# EAGLE design flower (EAGLE 7.7.0)
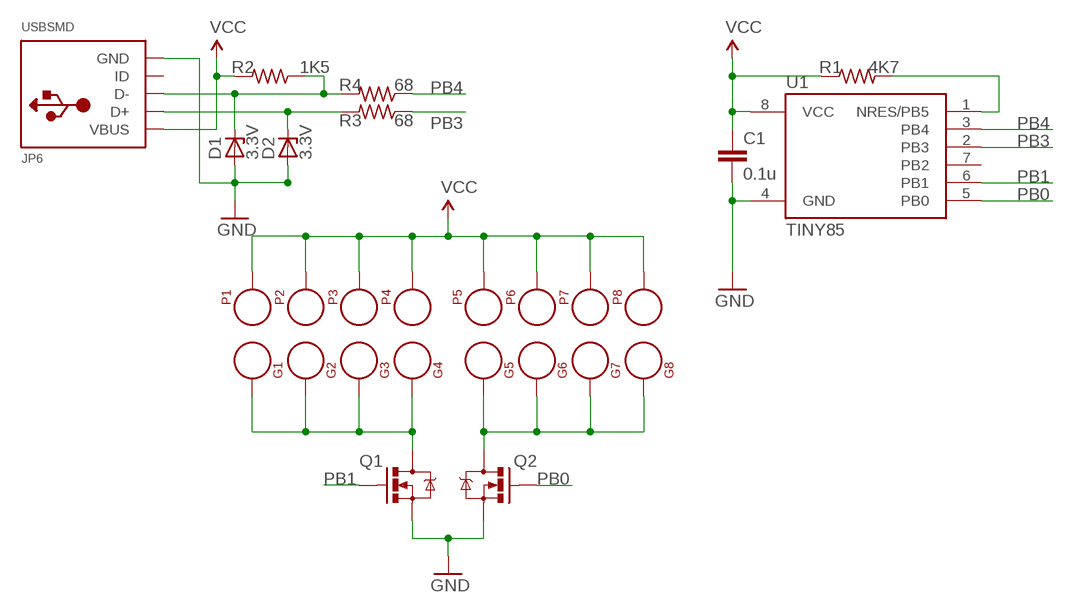
[diagram p0: schematic, sheet 1]

## Parts
C1  0.1u  C-EU025-025X050  [C025-025X050]
D1  3.3V  ZENER-DIODEZD-5  [ZDIO-5]
D2  3.3V  ZENER-DIODEZD-5  [ZDIO-5]
G1  SEW_HOLE  [SIMPLE_HOLE]
G2  SEW_HOLE  [SIMPLE_HOLE]
G3  SEW_HOLE  [SIMPLE_HOLE]
G4  SEW_HOLE  [SIMPLE_HOLE]
G5  SEW_HOLE  [SIMPLE_HOLE]
G6  SEW_HOLE  [SIMPLE_HOLE]
G7  SEW_HOLE  [SIMPLE_HOLE]
G8  SEW_HOLE  [SIMPLE_HOLE]
JP6  USBSMD  USBMOLEX  [USB-MINIB-THM-MOLEX]
P1  SEW_HOLE  [SIMPLE_HOLE]
P2  SEW_HOLE  [SIMPLE_HOLE]
P3  SEW_HOLE  [SIMPLE_HOLE]
P4  SEW_HOLE  [SIMPLE_HOLE]
P5  SEW_HOLE  [SIMPLE_HOLE]
P6  SEW_HOLE  [SIMPLE_HOLE]
P7  SEW_HOLE  [SIMPLE_HOLE]
P8  SEW_HOLE  [SIMPLE_HOLE]
Q1  2N7000  MOSFET-NCHANNEL2N7000  [TO-92]
Q2  2N7000  MOSFET-NCHANNEL2N7000  [TO-92]
R1  4K7  R-US_0204/7  [0204/7]
R2  1K5  R-US_0204/7  [0204/7]
R3  68  R-US_0204/7  [0204/7]
R4  68  R-US_0204/7  [0204/7]
U1  TINY85  ATTINY85-P  [PDIP08_300MIL]

## Nets
A: G5.P$1 G6.P$1 G7.P$1 G8.P$1 Q2.3(D)
B: G1.P$1 G2.P$1 G3.P$1 G4.P$1 Q1.3(D)
GND: C1.2 D1.A D2.A JP6.GND Q1.1(S) Q2.1(S) U1.4(GND)
N$2: D2.C JP6.D+ R3.2
N$3: R1.2 U1.1(NRES/PB5)
N$6: D1.C JP6.D- R2.1 R4.2
PB0: Q2.2(G) U1.5(PB0)
PB1: Q1.2(G) U1.6(PB1)
PB3: R4.1 U1.2(PB3)
PB4: R3.1 U1.3(PB4)
VCC: C1.1 JP6.VBUS P1.P$1 P2.P$1 P3.P$1 P4.P$1 P5.P$1 P6.P$1 P7.P$1 P8.P$1 R1.1 R2.2 U1.8(VCC)
Unconnected: JP6.ID U1.7(PB2)

## Library data of the parts
C1 = rcl:C-EU: CAPACITOR, European symbol
D1 D2 = diode:ZENER-DIODE: Z-Diode
G1-G8 P1-P8 = LilyPad-Wearables:SEW_HOLE: Simple sew-hole .1" diameter hole with 20mil annular ring
JP6 = adafruit:USB: USB Connectors USBMINIB - Surface Mount Female Mini-B USB Connector 4UConnector: 06564 By microbuilder.eu Thru-hole RA Female Mini-B USB Connector 4UConnector: 18732 By ladyada.net
Q1 Q2 = SparkFun-DiscreteSemi:MOSFET-NCHANNEL: Common NMOSFET Parts MFG P/N Store ID Prod ID FDD8780 TRANS-09984 SI7820DN TRANS-11055 FDS6630A IC-08089 2N7002PW TRANS-11151 FQP30N06L COM-10213 TRANS-10060 BSS123LT1G TRANS-08345 BSS138 TRANS-00830 BS170 2N7000
R1-R4 = resistor:R-US_: RESISTOR, American symbol
U1 = _hhn_attiny25_45_85:ATTINY85*: ATMEL ATtiny 85 Packages: P = PDIP 08 30mil S = SOIC 08 EIAJ 208mil Technologies Note: for complete ordering code (temp. range, finish, tape&reel etc.) see www.atmel.com • Supply Voltage: V = (1.8…5.5)V | [blank] = (2.7…5.5)V • Speed: 10 = 10 MHz | 20 = 20 MHz Author: Dipl.-Ing. FH Rainer Bayer HHN Hochschule Heilbronn (Heilbronn University), rainer.bayer@hs-heilbronn.de Ingenieurbüro ing-rb, mail@ing-rb.de

## Board
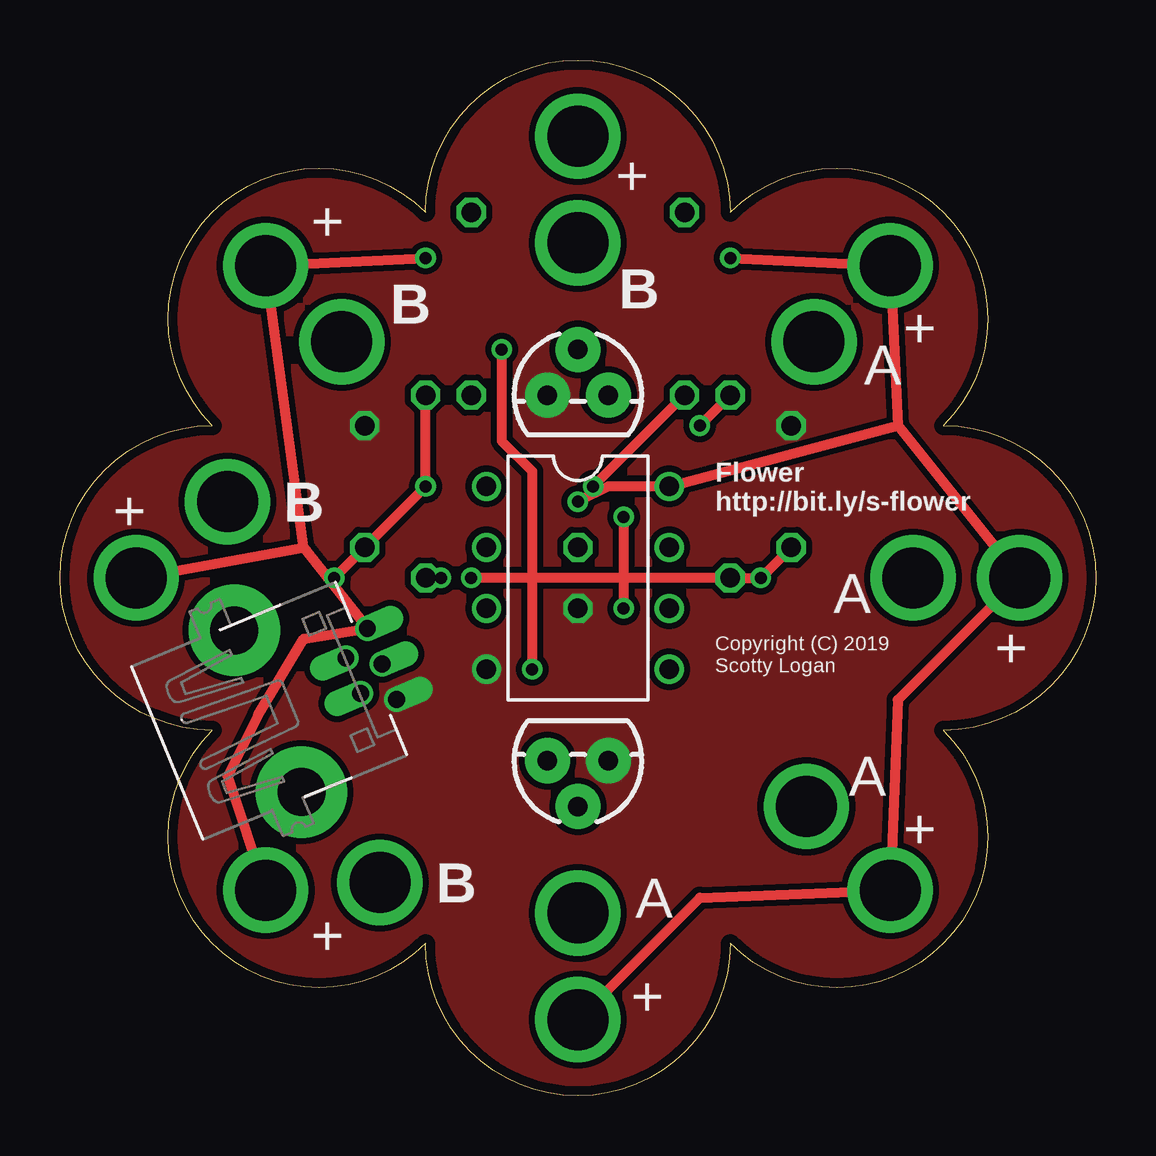
[diagram p1: board, top side]
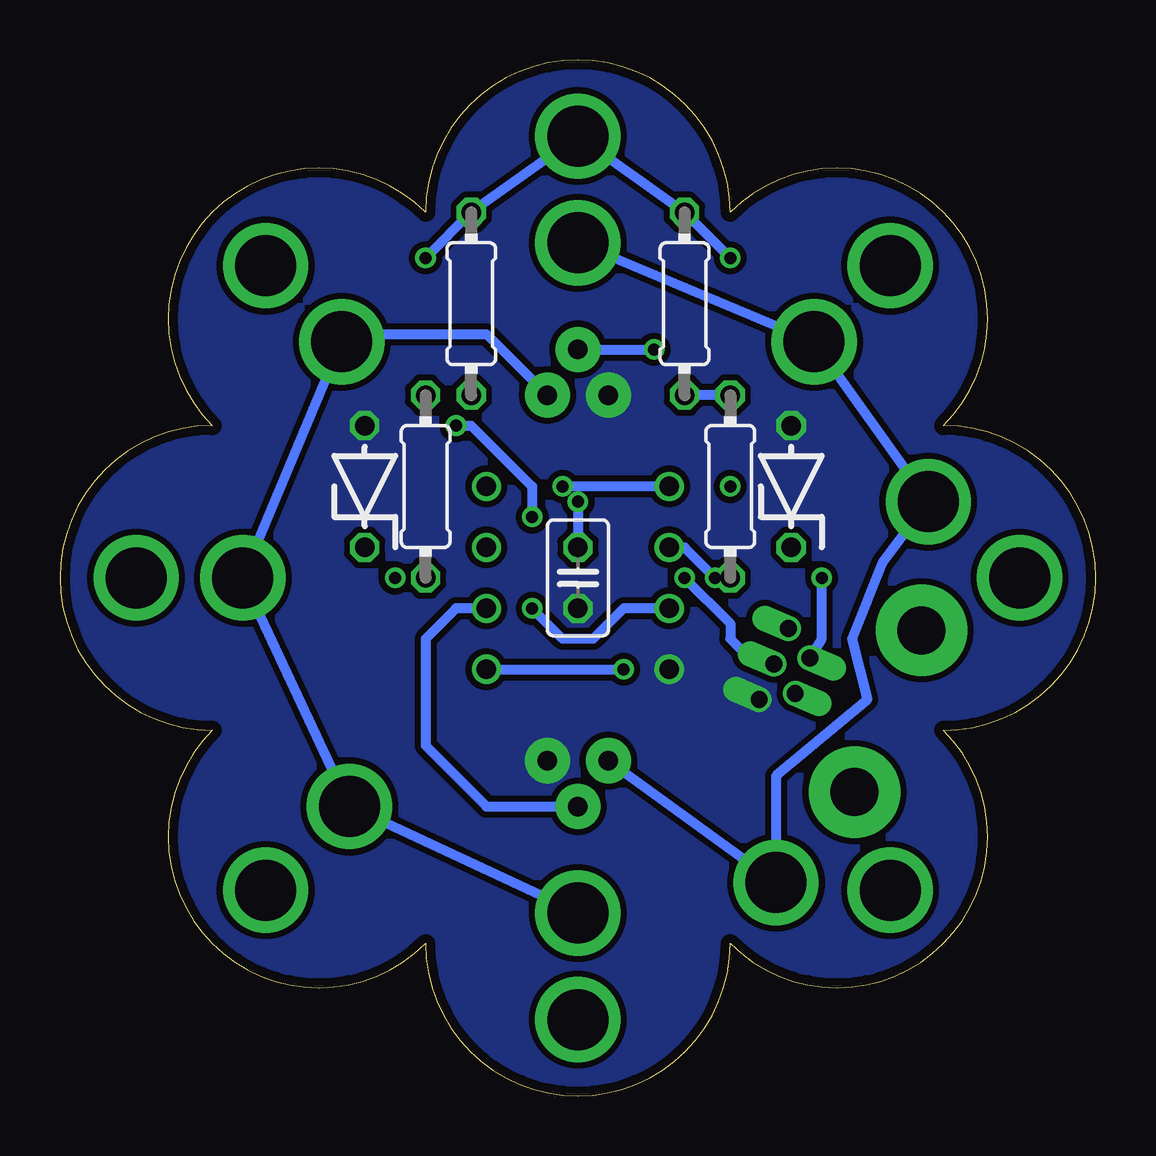
[diagram p2: board, bottom side, seen from below]

Size 43.18 x 43.18 mm. Coordinates in mm from the lower left corner, seen from the top.
Outline: 15.24,6.35 arc-180 6.35,15.24 arc-180 6.35,27.94 arc-180 15.24,36.83 arc-180 27.94,36.83 arc-180 36.83,27.94 arc-180 36.83,15.24 arc-180 27.94,6.35 arc-180 15.24,6.35
Copper layers (1*16): Top 0.0356mm / dielectric 1.5011mm / Bottom 0.0356mm
Design rules "OSH Park PCB Order": minimum track width 6mil, minimum drill 13mil, track to track 6mil, track to pad 6mil, pad to pad 6mil, via to via 6mil, smd to smd 6mil, copper to edge 15mil, drill to drill 6mil, minimum pad ring 7mil, minimum via ring 7mil, stop-mask expansion 3mil, vias tented up to drill 0mil, thermal gap 10mil

### Footprints (pad centres in the part's own frame; a part is rotated, then mirrored left to right if it is on the bottom)
C025-025X050 = drill 0.813 octagon: 1 -1.27,0; 2 1.27,0
ZDIO-5 = drill 0.813 octagon: A 2.54,0; C -2.54,0
SIMPLE_HOLE = drill 2.54 pad 3.048: P$1 0,0
USB-MINIB-THM-MOLEX = drill 0.7 offset: D+ 0,9.72; D- -0.8,8.42; GND 1.6,9.72; ID 0.8,8.42; VBUS -1.6,9.72 | drill 2 pad 3.81: GND1 -3.65,4.57; GND4 3.65,4.57
TO-92 = drill 0.813 pad 1.88: 1 -1.27,0; 2 0,1.905; 3 1.27,0
0204/7 = drill 0.813 octagon: 1 -3.81,0; 2 3.81,0
PDIP08_300MIL = drill 0.813: 1 -3.81,-3.81; 2 -1.27,-3.81; 3 1.27,-3.81; 4 3.81,-3.81; 5 3.81,3.81; 6 1.27,3.81; 7 -1.27,3.81; 8 -3.81,3.81

### Placement (x,y rotation side)
C1  21.59,21.59 270 bottom
D1  12.7,25.4 90 bottom
D2  30.48,25.4 90 bottom
G1  11.75,31.43 0 top
G2  21.59,35.56 0 top
G3  6.99,24.77 0 top
G4  13.34,8.89 0 top
G5  31.43,31.43 0 top
G6  21.59,7.62 0 top
G7  31.11,12.07 0 top
G8  35.56,21.59 0 top
JP6  4.45,14.29 292.5 top
P1  8.57,8.57 0 top
P2  34.61,34.61 0 top
P3  40.01,21.59 0 top
P4  21.59,40.01 0 top
P5  8.57,34.61 0 top
P6  21.59,3.18 0 top
P7  34.61,8.57 0 top
P8  3.17,21.59 0 top
Q1  21.59,13.97 180 top
Q2  21.59,29.21 0 top
R1  26.04,33.02 270 bottom
R2  17.14,33.02 90 bottom
R3  27.94,25.4 270 bottom
R4  15.24,25.4 90 bottom
U1  21.59,21.59 270 top

### Tracks (layer width: path | path; a pad name or v marks a point on that pad's centre or on a via)
A
  Bottom 0.406: G6.P$1 G7.P$1 G8.P$1 G5.P$1 31.11,31.75 25.4,31.75 Q2.3
B
  Bottom 0.406: G2.P$1 G1.P$1 G3.P$1 8.89,22.23 10.16,19.05 9.53,16.51 13.34,13.34 G4.P$1 Q1.3
GND
  pour Top (isolate 0.254, no thermals): 0,0 43.18,0 43.18,43.18 0,43.18
  pour Bottom (isolate 0.254, no thermals): 0,0 43.18,0 43.18,43.18 0,43.18
N$2  (via drill 0.5)
  Top 0.406: D2.C v29.21,21.59 R3.2 v17.14,21.59
  Bottom 0.406: v17.14,21.59 15.24,19.69 15.24,19.05 14.61,18.41 JP6.D+
N$3  (via drill 0.5)
  Top 0.406: v22.23,25.4 R1.2
  Bottom 0.406: U1.1 v22.23,25.4
N$6  (via drill 0.5)
  Top 0.406: v11.43,21.59 D1.C v15.24,25.4 R4.2
  Bottom 0.406: R4.2 R2.1 | JP6.D- 11.43,19.05 v11.43,21.59
PB0  (via drill 0.5)
  Top 0.406: v18.41,31.12 18.41,27.3 19.68,26.04 v19.68,17.78
  Bottom 0.406: U1.5 v19.68,17.78 | Q2.2 v18.41,31.12
PB1
  Bottom 0.406: U1.6 26.67,20.32 27.94,19.05 27.94,14.61 25.4,12.07 Q1.2
PB3  (via drill 0.5)
  Top 0.406: R4.1 v15.88,21.59
  Bottom 0.406: v15.88,21.59 17.14,22.86 U1.2
PB4  (via drill 0.5)
  Top 0.406: R3.1 v26.67,27.94 | v23.5,24.13 v23.5,20.32
  Bottom 0.406: v26.67,27.94 26.04,27.94 23.5,25.4 v23.5,24.13 | U1.3 19.68,20.32 20.95,19.05 22.23,19.05 v23.5,20.32
VCC  (via drill 0.5)
  Top 0.406: 34.92,27.94 P2.P$1 v27.94,34.92 | 34.92,27.94 P3.P$1 34.92,16.51 P7.P$1 26.67,8.26 P6.P$1 | v15.24,34.92 P5.P$1 10.16,22.86 | P8.P$1 10.16,22.86 | 10.16,22.86 JP6.VBUS 10.16,19.05 8.26,15.88 6.99,13.34 P1.P$1 | 34.92,27.94 U1.8 22.86,25.4 v21.59,24.77
  Bottom 0.406: v15.24,34.92 R2.2 P4.P$1 R1.1 v27.94,34.92 | v21.59,24.77 C1.1

### Text on the board
tNames: + | + | B | B | + | A | B | Flower / http://bit.ly/s-flower | + | A | + | Copyright (C) 2019 / Scotty Logan | A | + | B | A | + | +